# Altium project Dev Board.PrjPcb (part 1 of 2)
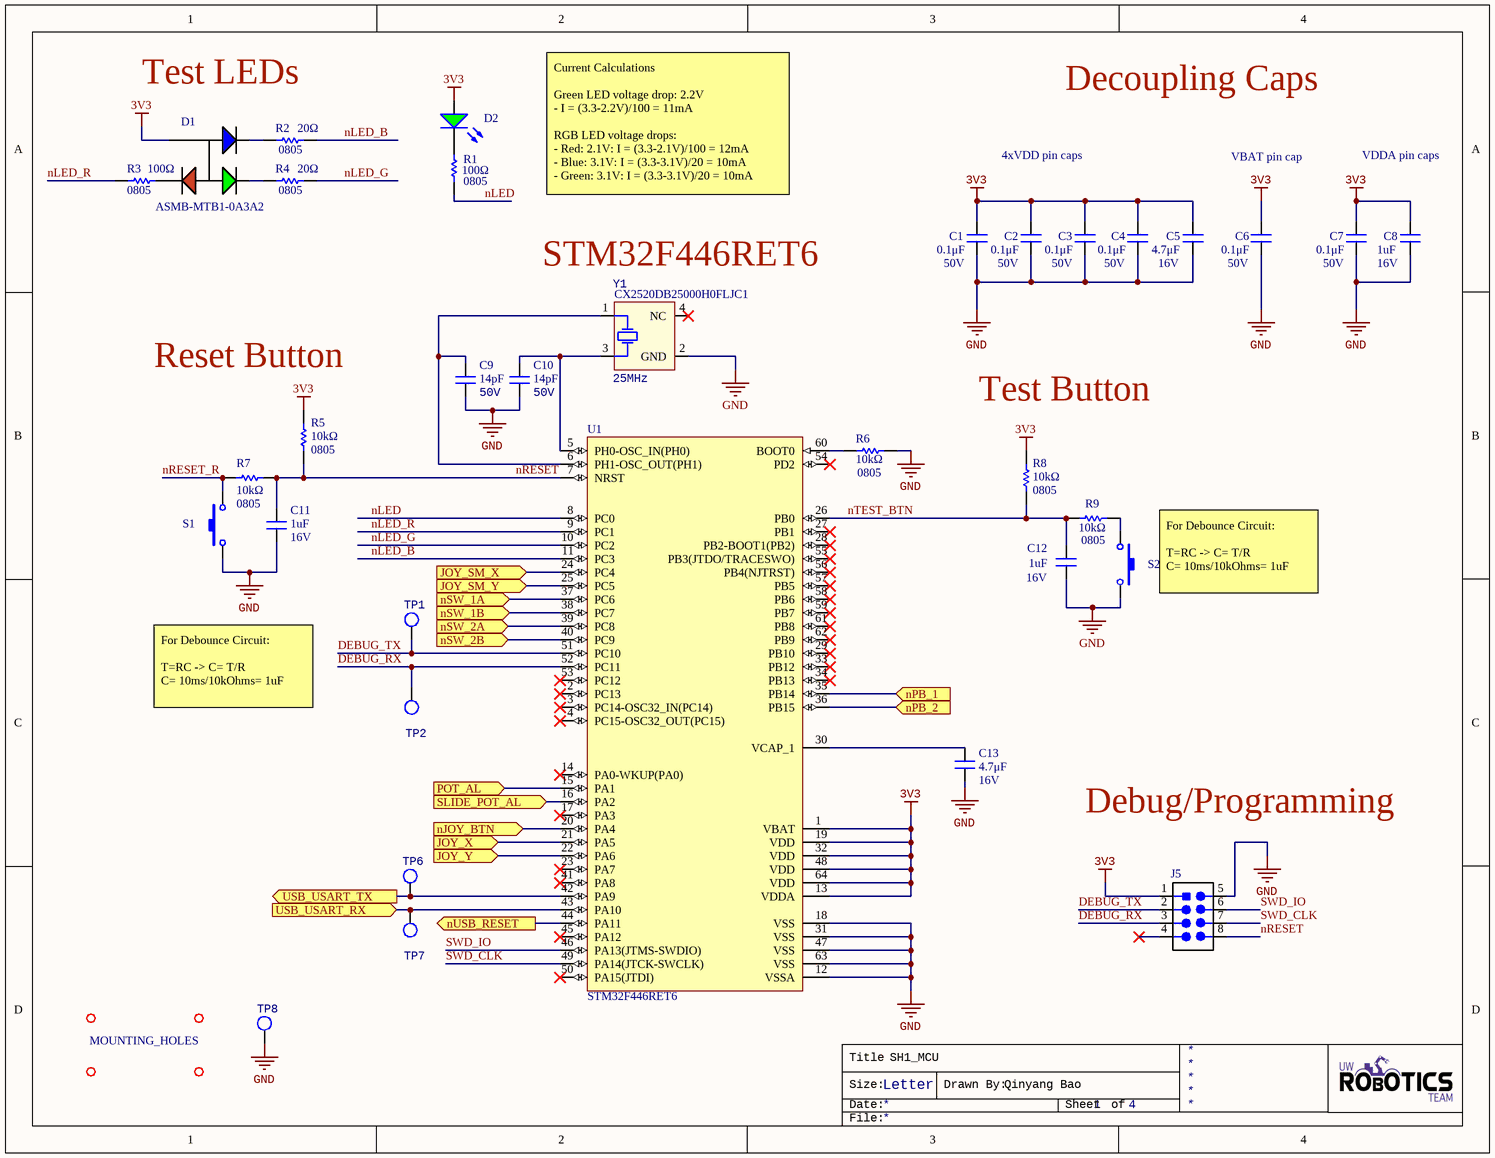
[diagram p0: SH1-MCU.SchDoc]
4 sheets, 108 parts. Net scope: flat (ports and power ports of the same name join across sheets).
Board file: Dev Board.PcbDoc
Sheets:
  SH1-MCU.SchDoc
  SH2-CONTROLS.SchDoc
  SH3-FTDI.SchDoc
  SH4-POWER.SchDoc

## Sheet SH1-MCU.SchDoc: SH1_MCU
size Letter; DrawnBy: Qinyang Bao; SheetNumber: 1; SheetTotal: 4

### Parts
C1  Voltage Rating: 50V  [CAPC2012X140N]  (hidden comment: 0.1μF)
C2  Voltage Rating: 50V  [CAPC2012X140N]  (hidden comment: 0.1μF)
C3  Voltage Rating: 50V  [CAPC2012X140N]  (hidden comment: 0.1μF)
C4  Voltage Rating: 50V  [CAPC2012X140N]  (hidden comment: 0.1μF)
C5  value 4.7μF  Voltage Rating: 16V  [CAPC2012X140N]  (hidden comment: CAP_4.7uF_16V_0805)
C6  Voltage Rating: 50V  [CAPC2012X140N]  (hidden comment: 0.1μF)
C7  Voltage Rating: 50V  [CAPC2012X140N]  (hidden comment: 0.1μF)
C8  value 1uF  Voltage Rating: 16V  [CAPC2012X140N]  (hidden comment: CAP_1uF_16V_0805)
C9  value 14pF  Voltage Rating (DC): 50V  [CAPC0603(1608)55_N]  (hidden comment: CL10C140JB8NNNC)
C10  value 14pF  Voltage Rating (DC): 50V  [CAPC0603(1608)55_N]  (hidden comment: CL10C140JB8NNNC)
C11  value 1uF  Voltage Rating: 16V  [CAPC2012X140N]  (hidden comment: CAP_1uF_16V_0805)
C12  value 1uF  Voltage Rating: 16V  [CAPC2012X140N]  (hidden comment: CAP_1uF_16V_0805)
C13  value 4.7μF  Voltage Rating: 16V  [CAPC2012X140N]  (hidden comment: CAP_4.7uF_16V_0805)
D1  Manufacturer Part Number 1: ASMB-MTB1-0A3A2  [LED_RGB]  (hidden comment: LED_RGB)
D2  LG R971-KN-1  [LED_0805_LINE]  (value not drawn)
J5  HEADER 4X2  [HEADER_2X4]  (value not drawn)
MH1  MOUNTING_HOLES  [MOUNTING_HOLE]  (value not drawn)
MH2  MOUNTING_HOLES  [MOUNTING_HOLE]  (value not drawn)
MH3  MOUNTING_HOLES  [MOUNTING_HOLE]
MH4  MOUNTING_HOLES  [MOUNTING_HOLE]  (value not drawn)
R1  value 100Ω  Case Code (Imperial): 0805  [RESC2012X60N]  (hidden comment: RES_100Ω_0805)
R2  value 20Ω  Case Code (Imperial): 0805  [RESC2012X60N]  (hidden comment: RES_20Ω_0805)
R3  value 100Ω  Case Code (Imperial): 0805  [RESC2012X60N]  (hidden comment: RES_100Ω_0805)
R4  value 20Ω  Case Code (Imperial): 0805  [RESC2012X60N]  (hidden comment: RES_20Ω_0805)
R5  value 10kΩ  Case Code (Imperial): 0805  [RESC2012X60N]  (hidden comment: RES_10kΩ_0805)
R6  value 10kΩ  Case Code (Imperial): 0805  [RESC2012X60N]  (hidden comment: RES_10kΩ_0805)
R7  value 10kΩ  Case Code (Imperial): 0805  [RESC2012X60N]  (hidden comment: RES_10kΩ_0805)
R8  value 10kΩ  Case Code (Imperial): 0805  [RESC2012X60N]  (hidden comment: RES_10kΩ_0805)
R9  value 10kΩ  Case Code (Imperial): 0805  [RESC2012X60N]  (hidden comment: RES_10kΩ_0805)
S1  SW_TACTILE  [B3U-1000P]  (value not drawn)
S2  SW_TACTILE  [B3U-1000P]  (value not drawn)
TP1  TESTPOINT_LOOP  [TESTPOINT_LOOP]  (value not drawn)
TP2  TESTPOINT_LOOP  [TESTPOINT_LOOP]  (value not drawn)
TP6  TESTPOINT_LOOP  [TESTPOINT_LOOP]  (value not drawn)
TP7  TESTPOINT_LOOP  [TESTPOINT_LOOP]  (value not drawn)
TP8  TESTPOINT_LOOP  [TESTPOINT_LOOP]  (value not drawn)
U1  STM32F446RET6  [STM-LQFP64_L]
Y1  Manufacturer Part Number 1: CX2520DB25000H0FLJC1  Frequency: 25MHz  [SOIC254P1016X440-4N]  (hidden comment: CRYSTAL_25MHZ)

### Ports
JOY_SM_X (in), JOY_SM_Y (in), JOY_X (in), JOY_Y (in), nJOY_BTN (in), nPB_1 (in), nPB_2 (in), nSW_1A (in), nSW_1B (in), nSW_2A (in), nSW_2B (in), nUSB_RESET (out), POT_AL (in), SLIDE_POT_AL (in), USB_USART_RX (in), USB_USART_TX (out)

### Nets
3V3: C1.2 C2.2 C3.2 C4.2 C5.2 C6.2 C7.2 C8.2 D1.4 D2.1(A) J5.1(VCC) R5.2 R8.2 U1.1(VBAT) U1.13(VDDA) U1.19(VDD) U1.32(VDD) U1.48(VDD) U1.64(VDD)
GND: C1.1 C2.1 C3.1 C4.1 C5.1 C6.1 C7.1 C8.1 C9.1 C10.1 C11.1 C12.1 C13.1 J5.5(GND) R6.2 S1.2 S2.2 TP8.1 U1.12(VSSA) U1.18(VSS) U1.31(VSS) U1.47(VSS) U1.63(VSS) Y1.2(GND)
DEBUG_RX: J5.3 TP2.1 U1.52(PC11)
DEBUG_TX: J5.2 TP1.1 U1.51(PC10)
nLED: R1.1 U1.8(PC0)
nLED_B: R2.2 U1.11(PC3)
nLED_G: R4.2 U1.10(PC2)
nLED_R: R3.1 U1.9(PC1)
nRESET: C11.2 J5.8 R5.1 R7.2 U1.7(NRST)
nRESET_R: R7.1 S1.1
nTEST_BTN: C12.2 R8.1 R9.1 U1.26(PB0)
SWD_CLK: J5.7 U1.49(PA14(JTCK-SWCLK))
SWD_IO: J5.6 U1.46(PA13(JTMS-SWDIO))
NetC9_2: C9.2 U1.6(PH1-OSC_OUT(PH1)) Y1.1(HOT)
NetC10_2: C10.2 U1.5(PH0-OSC_IN(PH0)) Y1.3(HOT)
NetC13_2: C13.2 U1.30(VCAP_1)
NetC14_2: U1.25(PC5) ; port JOY_SM_Y
NetC15_2: U1.24(PC4) ; port JOY_SM_X
NetC16_2: U1.37(PC6) ; port nSW_1A
NetC17_2: U1.38(PC7) ; port nSW_1B
NetC18_2: U1.39(PC8) ; port nSW_2A
NetC19_2: U1.40(PC9) ; port nSW_2B
NetC20_2: U1.20(PA4) ; port nJOY_BTN
NetC21_2: U1.21(PA5) ; port JOY_X
NetC22_2: U1.22(PA6) ; port JOY_Y
NetC23_2: U1.15(PA1) ; port POT_AL
NetC24_2: U1.35(PB14) ; port nPB_1
NetC25_2: U1.16(PA2) ; port SLIDE_POT_AL
NetC26_2: U1.36(PB15) ; port nPB_2
NetD1_1: D1.1 R3.2
NetD1_2: D1.2 R4.1
NetD1_3: D1.3 R2.1
NetD2_2: D2.2(K) R1.2
NetR6_1: R6.1 U1.60(BOOT0)
NetR9_2: R9.2 S2.1
NetR35_1: U1.44(PA11) ; port nUSB_RESET
NetTP6_1: TP6.1 U1.42(PA9) ; port USB_USART_TX
NetTP7_1: TP7.1 U1.43(PA10) ; port USB_USART_RX

Not connected (* = marked no-connect by the designer): J5 4*; U1 2(PC13)* 3(PC14-OSC32_IN(PC14))* 4(PC15-OSC32_OUT(PC15))* 14(PA0-WKUP(PA0))* 17(PA3)* 23(PA7)* 27(PB1)* 28(PB2-BOOT1(PB2))* 29(PB10)* 33(PB12)* 34(PB13)* 41(PA8)* 45(PA12)* 50(PA15(JTDI))* 53(PC12)* 54(PD2)* 55(PB3(JTDO/TRACESWO))* 56(PB4(NJTRST))* 57(PB5)* 58(PB6)* 59(PB7)* 61(PB8)* 62(PB9)*; Y1 4(NC)*

### Notes on the sheet
- Test LEDs
- Decoupling Caps
- 4xVDD pin caps
- VBAT pin cap
- VDDA pin caps
- Current Calculations
  Green LED voltage drop: 2.2V
  - I = (3.3-2.2V)/100 = 11mA
  RGB LED voltage drops:
  - Red: 2.1V: I = (3.3-2.1V)/100 = 12mA
  - Blue: 3.1V: I = (3.3-3.1V)/20 = 10mA
  - Green: 3.1V: I = (3.3-3.1V)/20 = 10mA
- (near Y1) STM32F446RET6
- (near R5) Reset Button
- Test Button
- For Debounce Circuit:
  T=RC -> C= T/R
  C= 10ms/10kOhms= 1uF
- Debug/Programming
- Title
- Size:
- Date:
- Letter
- Drawn By:
- Sheet
- of
- File:

### Library data of the parts
C1-C4 C6 C7 = CAP_0.1uF_50V_0805: CAP CER 0.1UF 50V X7R 0805; Manufacturer 1: Murata Electronics; Manufacturer Part Number 1: GCD21BR71H104KA01L; Tolerance: 10%; Mount: Surface Mount; Case Code (Metric): 2012; Case Code (Imperial): 0805; Min Operating Temperature: -55°C; Max Operating Temperature: 125°C; Dielectric: X7R; Termination: SMD/SMT; Length: 2mm; Height: 1.25mm; Width: 0.049inch; Thickness: 0.049inch; Depth: 1.25mm; Ratings: AEC-Q200; ComponentLink1URL: https://datasheet.ciiva.com/29537/c03e-29537701.pdf?src-supplier=Digi-Key; ComponentLink1Description: https://datasheet.ciiva.com/29537/c03e-29537701.pdf?src-supplier=Digi-Key; Supplier 1: Digi-Key; Supplier Part Number 1: 490-11955-1-ND; Value: 0.1μF; Package: 0805 (2012 Metric)
C5 C13 = CAP_4.7uF_16V_0805: CAP CER 4.7UF 16V X5R 0805; Manufacturer 1: Samsung Electro-Mechanics; Manufacturer Part Number 1: CL21A475KOFNNNE; Tolerance: 10%; Mount: Surface Mount; Case Code (Metric): 2012; Case Code (Imperial): 0805; Min Operating Temperature: -55°C; Max Operating Temperature: 85°C; Dielectric: X5R; Termination: SMD/SMT; Supplier 1: Digi-Key; Supplier Part Number 1: 1276-1065-1-ND; Package: 0805 (2012 Metric)
C8 C11 C12 = CAP_1uF_16V_0805: CAP CER 1UF 16V X7R 0805; Manufacturer 1: Yageo; Manufacturer Part Number 1: CC0805KKX7R7BB105; Tolerance: 10%; Mount: Surface Mount; Case Code (Metric): 2012; Case Code (Imperial): 0805; Min Operating Temperature: -55°C; Max Operating Temperature: 125°C; Dielectric: X7R; Termination: SMD/SMT; Supplier 1: Digi-Key; Supplier Part Number 1: 311-1365-1-ND; Package: 0805 (2012 Metric)
C9 C10 = CL10C140JB8NNNC: Cap Ceramic 14pF 50V C0G 5% SMD 0603 125C Cardboard T/R; Manufacturer 1: Samsung; Voltage Rating: 50V; Supplier Part Number 1: 1276-2187-1-ND; Supplier 1: Digi-Key; Manufacturer Part Number 1: CL10C140JB8NNNC; Stock 1: 187088; Pricing 1: 1=0.10000, 10=0.06700, 100=0.02980, 500=0.02130, 1000=0.01673 (USD); RoHS: Yes; Mount: Surface Mount; Case/Package: 0603; Case Code (Metric): 1608; Case Code (Imperial): 0603; Min Operating Temperature: -55°C; Max Operating Temperature: 125°C; Tolerance: 5%; Package Quantity: 1; Packaging: Tape and Reel; Dielectric: C0G; Length: 1.6mm; Height: 0.8mm; Width: 0.031inch; Depth: 0.8mm; Thickness: 0.035inch; Radiation Hardening: No; ComponentLink1URL: https://datasheet.ciiva.com/25782/cl10c140jb8nnnc-25782947.pdf?src-supplier=Digi-Key; ComponentLink1Description: https://datasheet.ciiva.com/25782/cl10c140jb8nnnc-25782947.pdf?src-supplier=Digi-Key; Capacitance: 14pF
D1 = LED_RGB: LED RGB DIFFUSED 4PLCC SMD; Manufacturer 1: Broadcom; Color: Blue,Green,Red; Lens Color: White; Viewing Angle: 115°; Lens Style: Round; Luminous Intensity: 350mcd; Dominant Wavelength: 470nm; Forward Voltage: 3.1V; Test Current: 20mA; Supplier 1: Digi-Key; Stock 1: 142531; Pricing 1: 1=0.60000, 10=0.47100, 100=0.30210, 500=0.25980, 1000=0.20059 (USD); RoHS: Yes; Mount: Surface Mount; Case/Package: PLCC; Number of Pins: 4; Packaging: Cut Tape; Lens Transparency: Diffused; Length: 3.2mm; Height: 1.9mm; Width: 2.8mm; REACH SVHC: No SVHC; ComponentLink1URL: http://www.farnell.com/datasheets/2111106.pdf?src-supplier=Farnell; ComponentLink1Description: http://www.farnell.com/datasheets/2111106.pdf?src-supplier=Farnell; ComponentLink2URL: https://docs.broadcom.com/docs/AV02-4194EN?src-supplier=Digi-Key; ComponentLink2Description: https://docs.broadcom.com/docs/AV02-4194EN?src-supplier=Digi-Key; ComponentLink3URL: http://www.farnell.com/datasheets/1801564.pdf?src-supplier=Element14; ComponentLink3Description: http://www.farnell.com/datasheets/1801564.pdf?src-supplier=Element14; ComponentLink4URL: http://www.farnell.com/datasheets/2111106.pdf?src-supplier=Newark; ComponentLink4Description: http://www.farnell.com/datasheets/2111106.pdf?src-supplier=Newark; Supplier Part Number 1: 516-3280-1-ND
D2 = DIO_LED_G: LED GREEN DIFFUSED 0805 SMD; Manufacturer 1: OSRAM; Forward Voltage Drop: 2.2V; Package: 0805 (2012 Metric); Supplier Part Number 1: 475-1410-1-ND; Supplier 1: Digi-Key; Manufacturer Part Number 1: LG R971-KN-1; Mount: Surface Mount
J5 = HEADER 4X2: CONN HEADER VERT 8POS 2.54MM; Manufacturer Part Number 1: M20-9980445; Manufacturer 1: Harwin Inc.; Supplier Part Number 1: 952-2122-ND; Supplier 1: Digi-Key; Mount: Through Hole
MH1-MH4 = MOUNTING_HOLES: 6cm x 6cm
R1 R3 = RES_100Ω_0805: RES SMD 100 OHM 1% 1/8W 0805; Manufacturer 1: Yageo; Manufacturer Part Number 1: RC0805FR-07100RL; Power Rating: 125mW; Supplier 1: Digi-Key; Mount: Surface Mount; Case Code (Metric): 2012; Supplier Part Number 1: 311-100CRCT-ND; Package: 0805 (2012 Metric)
R2 R4 = RES_20Ω_0805: RES SMD 20 OHM 1% 1/8W 0805; Manufacturer 1: Yageo; Manufacturer Part Number 1: RC0805FR-0720RL; Resistance: 20; Power Rating: 125mW; Supplier 1: Digi-Key; Case Code (Metric): 2012; Min Operating Temperature: -55°C; Max Operating Temperature: 155°C; Tolerance: 1%; Termination: SMD/SMT; Supplier Part Number 1: 311-20.0CRCT-ND; Package: 0805 (2012 Metric)
R5-R9 = RES_10kΩ_0805: RES SMD 10K OHM 1% 1/8W 0805; Manufacturer 1: Yageo; Manufacturer Part Number 1: RC0805FR-0710KL; Power Rating: 125mW; Supplier 1: Digi-Key; Case Code (Metric): 2012; Min Operating Temperature: -55°C; Max Operating Temperature: 155°C; Resistance: 10K; Tolerance: 1%; Termination: SMD/SMT; Supplier Part Number 1: 311-10.0KCRCT-ND; Package: 0805 (2012 Metric)
S1 S2 = SW_TACTILE: Tactile Switch (Grey); Manufacturer 1: Omron Electronics Inc-EMC Div; Manufacturer Part Number 1: B3U-1000P; Supplier 1: Digi-Key; Supplier Part Number 1: SW1020CT-ND; Mount: Surface Mount
TP1 TP2 TP6-TP8 = TESTPOINT_LOOP: Loop testpoint through-hole pad; Manufacturer Part Number 1: 5002; Manufacturer 1: Keystone Electronics; Supplier Part Number 1: 36-5002-ND; Supplier 1: Digi-Key; Mount: Through Hole
U1 = MCU_STM32F446RET6: ARM Cortex-M4 32-bit MCU+FPU, 512 KB Flash, 128 KB Internal RAM, 50 I/Os, 64-Pin LQFP, -40 to 85 degC, Tray; I/Os (High Current): 50; Supply Voltage(Vcc) min (V): 1.7; Operating Frequency(F) (Processor speed) (MHz): 180; D/A Converter: 2; Internal RAM Size (kB): 128; FLASH Size (Prog) (kB): 512; Core: ARM Cortex-M4; ComponentLink1Description: Manufacturer URL; Package Reference: 64-Pin Low-profile Quad Flat Package, Body 10 x 10 mm, Pitch 0.5 mm; ComponentLink2URL: http://www.st.com/st-web-ui/static/active/en/resource/technical/document/datasheet/DM00141306.pdf; Packing: Tray; DatasheetVersion: Rev. 6; ComponentLink1URL: http://www.st.com/; ComponentLink2Description: Datasheet; Package Description: LQFP64; Mounting Technology: Surface Mount; Supplier Part Number 1: 497-15376-ND; Supplier 1: Digi-Key
Y1 = CRYSTAL_25MHZ: CRYSTAL 25.0000MHZ 12PF SMD; Manufacturer 1: Kyocera AVX; ESR (Equivalent Series Resistance): 80R; Frequency Stability: 15ppm; Frequency Tolerance: 10ppm; ComponentLink1Description: https://media.digikey.com/pdf/Data%20Sheets/AVX%20PDFs/CX2520DB_USY1M-H1-16429-00_Spec.pdf?src-supplier=Digi-Key; ComponentLink1URL: https://media.digikey.com/pdf/Data%20Sheets/AVX%20PDFs/CX2520DB_USY1M-H1-16429-00_Spec.pdf?src-supplier=Digi-Key; Supplier 1: Digi-Key; Supplier Part Number 1: 1253-1724-1-ND; Stock 1: 11741; Pricing 1: 1=0.72000, 10=0.63300, 50=0.59120, 100=0.52250, 500=0.49500, 1000=0.41250 (USD); RoHS: Yes; Mount: Surface Mount; Case/Package: SMD/SMT; Min Operating Temperature: -30°C; Max Operating Temperature: 85°C; Packaging: Tape and Reel; Load Capacitance: 12pF; Length: 0.098inch; Height: 0.022inch; Width: 0.079inch; Ratings: AEC-Q200

## Sheet SH2-CONTROLS.SchDoc: SH2-CONTROLS
size Letter; DrawnBy: Qinyang Bao; SheetNumber: 2; SheetTotal: 4
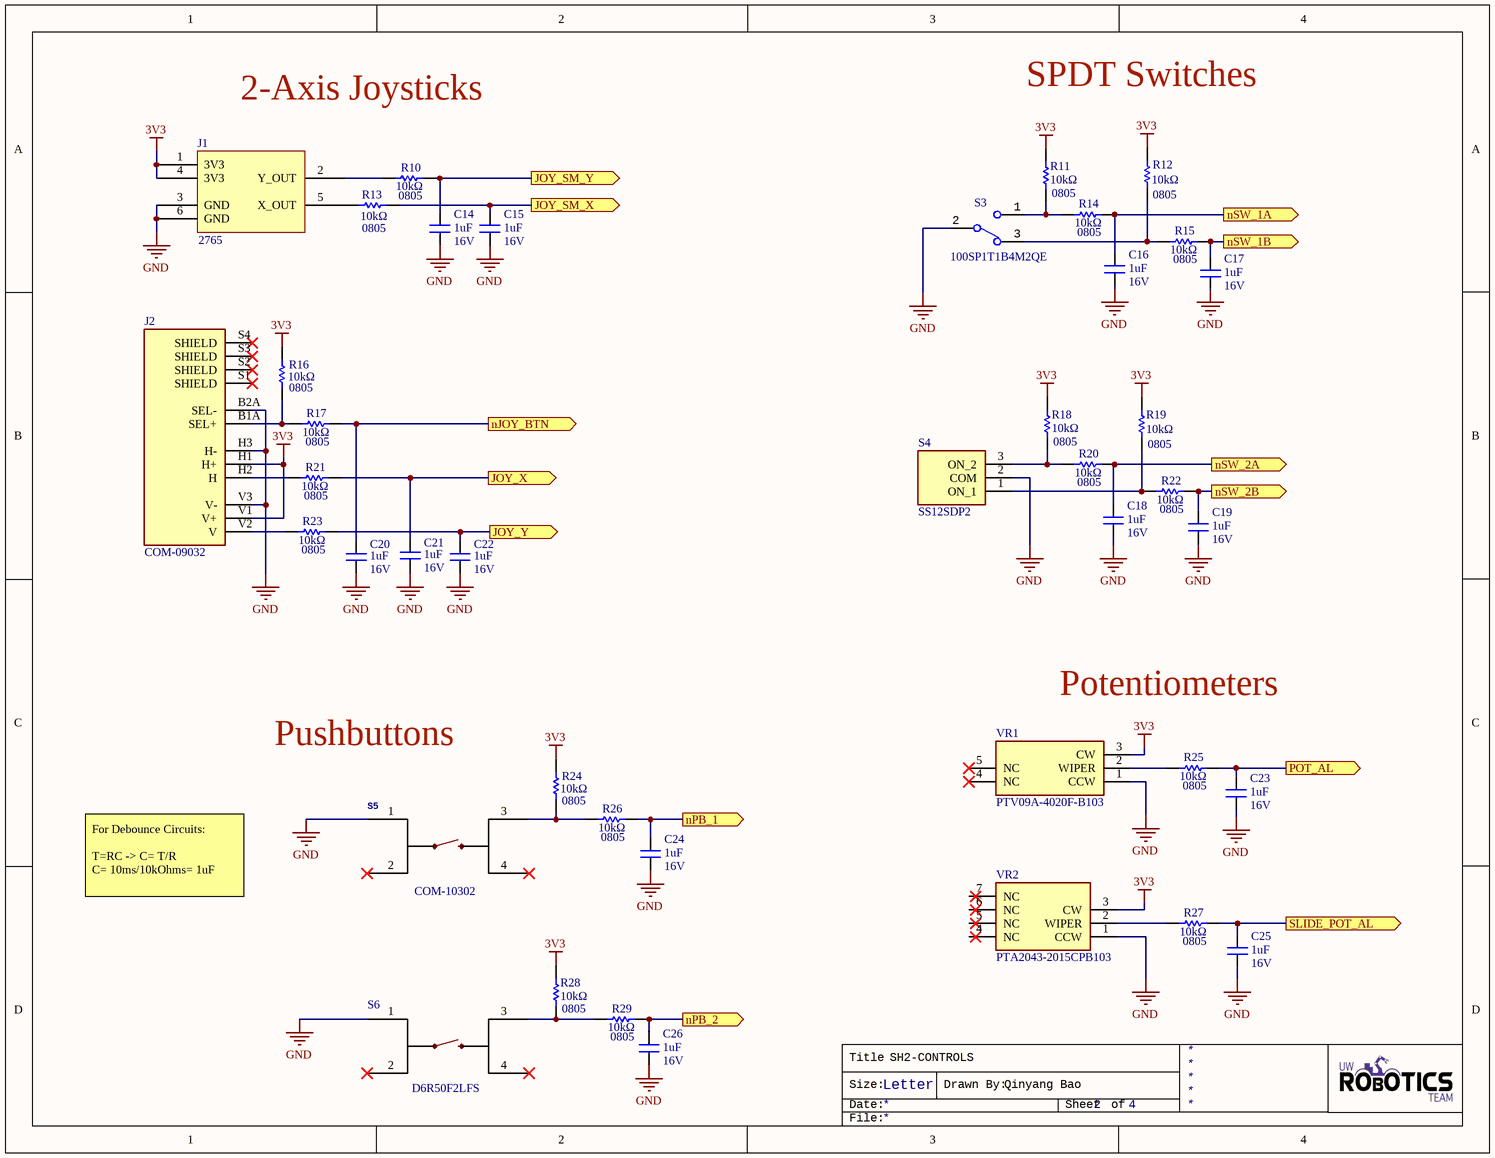
[diagram p1: SH2-CONTROLS.SchDoc]

### Parts
C14  value 1uF  Voltage Rating: 16V  [CAPC2012X140N]  (hidden comment: CAP_1uF_16V_0805)
C15  value 1uF  Voltage Rating: 16V  [CAPC2012X140N]  (hidden comment: CAP_1uF_16V_0805)
C16  value 1uF  Voltage Rating: 16V  [CAPC2012X140N]  (hidden comment: CAP_1uF_16V_0805)
C17  value 1uF  Voltage Rating: 16V  [CAPC2012X140N]  (hidden comment: CAP_1uF_16V_0805)
C18  value 1uF  Voltage Rating: 16V  [CAPC2012X140N]  (hidden comment: CAP_1uF_16V_0805)
C19  value 1uF  Voltage Rating: 16V  [CAPC2012X140N]  (hidden comment: CAP_1uF_16V_0805)
C20  value 1uF  Voltage Rating: 16V  [CAPC2012X140N]  (hidden comment: CAP_1uF_16V_0805)
C21  value 1uF  Voltage Rating: 16V  [CAPC2012X140N]  (hidden comment: CAP_1uF_16V_0805)
C22  value 1uF  Voltage Rating: 16V  [CAPC2012X140N]  (hidden comment: CAP_1uF_16V_0805)
C23  value 1uF  Voltage Rating: 16V  [CAPC2012X140N]  (hidden comment: CAP_1uF_16V_0805)
C24  value 1uF  Voltage Rating: 16V  [CAPC2012X140N]  (hidden comment: CAP_1uF_16V_0805)
C25  value 1uF  Voltage Rating: 16V  [CAPC2012X140N]  (hidden comment: CAP_1uF_16V_0805)
C26  value 1uF  Voltage Rating: 16V  [CAPC2012X140N]  (hidden comment: CAP_1uF_16V_0805)
J1  Manufacturer Part Number 1: 2765  [2_AXIS_JOY_SMALL]  (hidden comment: 2_AXIS_JOYSTICK_SMALL)
J2  Manufacturer Part Number 1: COM-09032  [2_AXIS_JOY]  (hidden comment: 2_AXIS_JOYSTICK)
R10  value 10kΩ  Case Code (Imperial): 0805  [RESC2012X60N]  (hidden comment: RES_10kΩ_0805)
R11  value 10kΩ  Case Code (Imperial): 0805  [RESC2012X60N]  (hidden comment: RES_10kΩ_0805)
R12  value 10kΩ  Case Code (Imperial): 0805  [RESC2012X60N]  (hidden comment: RES_10kΩ_0805)
R13  value 10kΩ  Case Code (Imperial): 0805  [RESC2012X60N]  (hidden comment: RES_10kΩ_0805)
R14  value 10kΩ  Case Code (Imperial): 0805  [RESC2012X60N]  (hidden comment: RES_10kΩ_0805)
R15  value 10kΩ  Case Code (Imperial): 0805  [RESC2012X60N]  (hidden comment: RES_10kΩ_0805)
R16  value 10kΩ  Case Code (Imperial): 0805  [RESC2012X60N]  (hidden comment: RES_10kΩ_0805)
R17  value 10kΩ  Case Code (Imperial): 0805  [RESC2012X60N]  (hidden comment: RES_10kΩ_0805)
R18  value 10kΩ  Case Code (Imperial): 0805  [RESC2012X60N]  (hidden comment: RES_10kΩ_0805)
R19  value 10kΩ  Case Code (Imperial): 0805  [RESC2012X60N]  (hidden comment: RES_10kΩ_0805)
R20  value 10kΩ  Case Code (Imperial): 0805  [RESC2012X60N]  (hidden comment: RES_10kΩ_0805)
R21  value 10kΩ  Case Code (Imperial): 0805  [RESC2012X60N]  (hidden comment: RES_10kΩ_0805)
R22  value 10kΩ  Case Code (Imperial): 0805  [RESC2012X60N]  (hidden comment: RES_10kΩ_0805)
R23  value 10kΩ  Case Code (Imperial): 0805  [RESC2012X60N]  (hidden comment: RES_10kΩ_0805)
R24  value 10kΩ  Case Code (Imperial): 0805  [RESC2012X60N]  (hidden comment: RES_10kΩ_0805)
R25  value 10kΩ  Case Code (Imperial): 0805  [RESC2012X60N]  (hidden comment: RES_10kΩ_0805)
R26  value 10kΩ  Case Code (Imperial): 0805  [RESC2012X60N]  (hidden comment: RES_10kΩ_0805)
R27  value 10kΩ  Case Code (Imperial): 0805  [RESC2012X60N]  (hidden comment: RES_10kΩ_0805)
R28  value 10kΩ  Case Code (Imperial): 0805  [RESC2012X60N]  (hidden comment: RES_10kΩ_0805)
R29  value 10kΩ  Case Code (Imperial): 0805  [RESC2012X60N]  (hidden comment: RES_10kΩ_0805)
S3  SW_SPDT  [100SP1T1B4M2QE]  (value not drawn)
S4  SW_SPDT_SMALL  [SS12SDP2]  (value not drawn)
S5  Manufacturer Part Number 1: COM-10302  [TACTILE_SWITCH_PTH_12MM]  (hidden comment: Pushbutton)
S6  Manufacturer Part Number 1: D6R50F2LFS  [D6R]  (hidden comment: MOMENTARY_SWITCH_D6R)
VR1  Manufacturer Part Number 1: PTV09A-4020F-B103  [PTV09A4020FB103]  (hidden comment: POT_10K)
VR2  Manufacturer Part Number 1: PTA2043-2015CPB103  [PTA20432015CPB103]  (hidden comment: POT_10K_SLIDE)

### Ports
JOY_SM_X (out), JOY_SM_Y (out), JOY_X (out), JOY_Y (out), nJOY_BTN (out), nPB_1 (out), nPB_2 (out), nSW_1A (out), nSW_1B (out), nSW_2A (out), nSW_2B (out), POT_AL (out), SLIDE_POT_AL (out)

### Nets
3V3: J1.1(3V3) J1.4(3V3) J2.H1(H+) J2.V1(V+) R11.1 R12.1 R16.1 R18.1 R19.1 R24.1 R28.1 VR1.3(CW) VR2.3(CW)
GND: C14.1 C15.1 C16.1 C17.1 C18.1 C19.1 C20.1 C21.1 C22.1 C23.1 C24.1 C25.1 C26.1 J1.3(GND) J1.6(GND) J2.B2A(SEL-) J2.H3(H-) J2.V3(V-) S3.2 S4.2(COM) S5.1 S6.1 VR1.1(CCW) VR2.1(CCW)
NetC14_2: C14.2 R10.2 ; port JOY_SM_Y
NetC15_2: C15.2 R13.2 ; port JOY_SM_X
NetC16_2: C16.2 R14.2 ; port nSW_1A
NetC17_2: C17.2 R15.2 ; port nSW_1B
NetC18_2: C18.2 R20.2 ; port nSW_2A
NetC19_2: C19.2 R22.2 ; port nSW_2B
NetC20_2: C20.2 R17.2 ; port nJOY_BTN
NetC21_2: C21.2 R21.2 ; port JOY_X
NetC22_2: C22.2 R23.2 ; port JOY_Y
NetC23_2: C23.2 R25.2 ; port POT_AL
NetC24_2: C24.2 R26.2 ; port nPB_1
NetC25_2: C25.2 R27.2 ; port SLIDE_POT_AL
NetC26_2: C26.2 R29.2 ; port nPB_2
NetJ1_2: J1.2(Y_OUT) R10.1
NetJ1_5: J1.5(X_OUT) R13.1
NetJ2_B1A: J2.B1A(SEL+) R16.2 R17.1
NetJ2_H2: J2.H2(H) R21.1
NetJ2_V2: J2.V2(V) R23.1
NetR11_2: R11.2 R14.1 S3.1
NetR12_2: R12.2 R15.1 S3.3
NetR18_2: R18.2 R20.1 S4.3(ON_2)
NetR19_2: R19.2 R22.1 S4.1(ON_1)
NetR24_2: R24.2 R26.1 S5.3
NetR25_1: R25.1 VR1.2(WIPER)
NetR27_1: R27.1 VR2.2(WIPER)
NetR28_2: R28.2 R29.1 S6.3

Not connected (* = marked no-connect by the designer): J2 S1(SHIELD)* S2(SHIELD)* S3(SHIELD)* S4(SHIELD)*; S5 2* 4*; S6 2* 4*; VR1 4(NC)* 5(NC)*; VR2 4(NC) 5(NC) 6(NC) 7(NC)

### Notes on the sheet
- SPDT Switches
- 2-Axis Joysticks
- Potentiometers
- Pushbuttons
- For Debounce Circuits:
  T=RC -> C= T/R
  C= 10ms/10kOhms= 1uF
- Title
- Size:
- Date:
- Letter
- Drawn By:
- Sheet
- of
- File:

### Library data of the parts
C14-C26 = CAP_1uF_16V_0805: as C8 on sheet SH1-MCU; Mount: Surface Mount; Case Code (Metric): 2012; Case Code (Imperial): 0805; Min Operating Temperature: -55°C; Max Operating Temperature: 125°C; Dielectric: X7R; Termination: SMD/SMT; Supplier 1: Digi-Key; Supplier Part Number 1: 311-1365-1-ND; Package: 0805 (2012 Metric)
J1 = 2_AXIS_JOYSTICK_SMALL: JOYSTICK 10K OHM 2 AXIS TH; Manufacturer 1: Adafruit Industries; Resistance: 10kR; Supplier 1: Digi-Key; Stock 1: 351; Pricing 1: 1=2.50000 (USD); RoHS: Yes; Mount: Through Hole; Packaging: Bulk; Length: 0.707inch; Height: 0.472inch; Width: 0.697inch; ComponentLink1URL: https://media.digikey.com/pdf/Data%20Sheets/Adafruit%20PDFs/2765_Web.pdf?src-supplier=Digi-Key; ComponentLink1Description: https://media.digikey.com/pdf/Data%20Sheets/Adafruit%20PDFs/2765_Web.pdf?src-supplier=Digi-Key; Supplier Part Number 1: 1528-1730-ND
J2 = 2_AXIS_JOYSTICK: JOYSTICK 10K OHM 2 AXIS TH; Manufacturer 1: SparkFun; Supplier 1: Digi-Key; Stock 1: 1039; Pricing 1: 1=3.95000 (USD); RoHS: No; ComponentLink1URL: https://media.digikey.com/pdf/Data%20Sheets/Sparkfun%20PDFs/COM-09032_Web.pdf?src-supplier=Digi-Key; ComponentLink1Description: https://media.digikey.com/pdf/Data%20Sheets/Sparkfun%20PDFs/COM-09032_Web.pdf?src-supplier=Digi-Key; Supplier Part Number 1: 1568-1526-ND
R10-R29 = RES_10kΩ_0805: as R5 on sheet SH1-MCU; Supplier 1: Digi-Key; Case Code (Metric): 2012; Min Operating Temperature: -55°C; Max Operating Temperature: 155°C; Resistance: 10K; Tolerance: 1%; Termination: SMD/SMT; Supplier Part Number 1: 311-10.0KCRCT-ND; Package: 0805 (2012 Metric)
S3 = SW_SPDT: SWITCH TOGGLE SPDT 5A 120V; Manufacturer 1: E-Switch; Actuator Material: Brass,Chrome; Switch Function: On-On; Voltage Rating (DC): 28V; Illumination Type: Non-Illuminated,Illuminated; Actuator Type: Standard Round; Electrical Life: 40000Cycles; Actuator Length: 12.19mm; ComponentLink1URL: https://datasheet.ciiva.com/24455/t111597-24455739.pdf?src-supplier=Onlinecomponents.com; ComponentLink1Description: https://datasheet.ciiva.com/24455/t111597-24455739.pdf?src-supplier=Onlinecomponents.com; ComponentLink2URL: https://datasheet.ciiva.com/2905/t111597-2905494.pdf?src-supplier=Digi-Key; ComponentLink2Description: https://datasheet.ciiva.com/2905/t111597-2905494.pdf?src-supplier=Digi-Key; Supplier 1: Digi-Key; Manufacturer Part Number 1: 100SP1T1B4M2QE; Stock 1: 4845; Pricing 1: 1=1.99000, 10=1.77900, 25=1.68240, 50=1.60200, 100=1.52950, 250=1.46512, 500=1.36850, 1000=1.30410 (USD); RoHS: Yes; Mount: Through Hole; Contact Material: Silver; Contact Plating: Silver; Min Operating Temperature: -30°C; Max Operating Temperature: 85°C; Package Quantity: 1; Current Rating: 5A; Voltage Rating (AC): 120V; Packaging: Bulk; Orientation: Vertical; Termination: PC Pin; Throw Configuration: SPDT; Lead Free: Lead Free; Supplier Part Number 1: EG2355-ND
S4 = SW_SPDT_SMALL: SWITCH SLIDE SPDT 100MA 30V; Manufacturer 1: NKK Switches; Actuator Material: Polyamide,Polyacetal; Mechanical Life: 10000Cycles; Switch Travel: 2mm; Illumination Type: Non-Illuminated; Switch Function: On-On; Voltage Rating (AC): 28V; Insulation Resistance: 100MR; Contact Resistance: 20mR; Number of Positions: 2; Actuator Type: Standard; Number of Poles: 1; Supplier 1: Digi-Key; Manufacturer Part Number 1: SS12SDP2; Stock 1: 4905; Pricing 1: 1=1.56000, 10=1.50000, 25=1.41000, 100=1.21800, 250=1.11000, 500=1.03200, 1000=0.96000, 2500=0.87000, 5000=0.81000 (USD); RoHS: Yes; Mount: PCB,Through Hole; Contact Material: Brass,Silver,Bronze; Contact Plating: Silver; Housing Material: Thermoplastic; Body Material: Polyamide,Polyacetal; Min Operating Temperature: -15°C; Max Operating Temperature: 60°C; Throw Configuration: SPDT; Packaging: Tray; Orientation: Straight; Termination: PC Pins; Voltage Rating (DC): 30V; Electrical Life: 10000Cycles; Current Rating: 100mA; Contact Current Rating: 100mA; Package Quantity: 1; Max Current Rating: 100mA; Max Voltage Rating (DC): 30V; Length: 10.2mm; Height: 6.5mm; Actuator Length: 2mm; Depth: 4mm; Lead Free: Lead Free; REACH SVHC: No SVHC; Flammability Rating: UL94 V-0; ComponentLink1URL: https://datasheet.ciiva.com/19453/1915771-19453348.pdf?src-supplier=Jameco; ComponentLink1Description: https://datasheet.ciiva.com/19453/1915771-19453348.pdf?src-supplier=Jameco; ComponentLink2URL: https://datasheet.ciiva.com/29119/704240-da-01-en-schiebes-spdt-on-on-2x2-oben-bet-silb-29119647.pdf?src-supplier=Conrad; ComponentLink2Description: https://datasheet.ciiva.com/29119/704240-da-01-en-schiebes-spdt-on-on-2x2-oben-bet-silb-29119647.pdf?src-supplier=Conrad; ComponentLink3URL: https://datasheet.ciiva.com/1532/10312-1532339.pdf?src-supplier=Element14; ComponentLink3Description: https://datasheet.ciiva.com/1532/10312-1532339.pdf?src-supplier=Element14; ComponentLink4URL: https://datasheet.ciiva.com/16394/ssnonilluminated-16394655.pdf?src-supplier=Future+Electronics; ComponentLink4Description: https://datasheet.ciiva.com/16394/ssnonilluminated-16394655.pdf?src-supplier=Future+Electronics; Supplier Part Number 1: 360-2133-ND
S5 = MOMENTARY_SWITCH_TH: Momentary Switch (Pushbutton) - SPST; Manufacturer 1: SparkFun; SymbolName_1: SWITCH-MOMENTARY-2; PROD_ID: SWCH-09185; SF_SKU: COM-09190; Package: TACTILE_SWITCH_PTH_12MM; Supplier 1: Digi-Key; Stock 1: 32; Pricing 1: 1=5.85000 (USD); RoHS: No; Mount: Through Hole; Throw Configuration: SPST; Termination: PC Pin; ComponentLink1URL: https://www.sparkfun.com/datasheets/Components/Buttons/TSA12110%20TACT%20SWITCH.jpg?src-supplier=Digi-Key; ComponentLink1Description: https://www.sparkfun.com/datasheets/Components/Buttons/TSA12110%20TACT%20SWITCH.jpg?src-supplier=Digi-Key; Supplier Part Number 1: 1568-1332-ND
S6 = MOMENTARY_SWITCH_D6R: SWITCH PUSH SPST-NO 0.1A 32V; Manufacturer 1: ITT C&K; Current Rating: 100mA; Throw Configuration: SPST; Operating Force: 2.5N; Actuator Type: Round, Button; Switch Function: Off-Mom; Electrical Life: 250000Cycles; Actuator Length: 7mm; Row Spacing: 5mm; Supplier 1: Digi-Key; Stock 1: 4683; Pricing 1: 1=1.10000, 10=0.98000, 25=0.93080, 50=0.88520, 100=0.84370, 250=0.80652, 500=0.72380, 1000=0.68244 (USD); RoHS: Yes; Mount: Through Hole; Contact Plating: Silver; Number of Terminals: 4; Min Operating Temperature: -20°C; Max Operating Temperature: 85°C; Max Voltage Rating (DC): 32V; Packaging: Bulk; Package Quantity: 2500; Voltage Rating (DC): 32V; Max Current Rating: 100mA; Orientation: Straight; Termination: PC Pin; Diameter: 12mm; Terminal Pitch: 5mm; Lead Free: Lead Free; ComponentLink1URL: https://datasheet.ciiva.com/2869/d6-31aug10-2869553.pdf?src-supplier=Digi-Key; ComponentLink1Description: https://datasheet.ciiva.com/2869/d6-31aug10-2869553.pdf?src-supplier=Digi-Key; ComponentLink2URL: https://datasheet.ciiva.com/12449/d6-31aug10-19155-12449292.pdf?src-supplier=Mouser; ComponentLink2Description: https://datasheet.ciiva.com/12449/d6-31aug10-19155-12449292.pdf?src-supplier=Mouser; ComponentLink3URL: https://datasheet.ciiva.com/16156/d6-4feb-16156540.pdf?src-supplier=Onlinecomponents.com; ComponentLink3Description: https://datasheet.ciiva.com/16156/d6-4feb-16156540.pdf?src-supplier=Onlinecomponents.com; Supplier Part Number 1: 401-1993-ND
VR1 = POT_10K: POT 10K OHM 1/20W CARBON LINEAR; Manufacturer 1: Bourns; Number of Turns: 1; Max Power Dissipation: 50mW; Resistance: 10kR; Tolerance: 20%; Voltage Rating (DC): 20V; Actuator Length: 0.787inch; Actuator Diameter: 0.236inch; ComponentLink1URL: https://datasheet.ciiva.com/6249/ptv09-6249579.pdf?src-supplier=Digi-Key; ComponentLink1Description: https://datasheet.ciiva.com/6249/ptv09-6249579.pdf?src-supplier=Digi-Key; Supplier 1: Digi-Key; Stock 1: 629; Pricing 1: 1=0.83000, 10=0.74400, 25=0.67200, 50=0.64800, 100=0.61200, 250=0.58800, 500=0.55200, 1000=0.45600, 5000=0.37200 (USD); RoHS: Yes; Mount: Through Hole,Snap in,Brackets; Min Operating Temperature: -10°C; Max Operating Temperature: 50°C; Taper: Linear; Termination: Pin; Number of Gangs: 1; Military Standard: Not; Composition: Carbon; Type: Potentiometer; Packaging: Bulk; Power Rating: 50mW; Package Quantity: 100; Voltage Rating: 20V; Length: 11.4mm; Depth: 12.5mm; Radiation Hardening: No; REACH SVHC: No SVHC; ComponentLink2URL: https://datasheet.ciiva.com/11831/0900766b80fa58ec-11831036.pdf?src-supplier=RSComponents; ComponentLink2Description: https://datasheet.ciiva.com/11831/0900766b80fa58ec-11831036.pdf?src-supplier=RSComponents; ComponentLink3URL: https://datasheet.ciiva.com/6249/ptv09-6249723.pdf?src-supplier=Digi-Key; ComponentLink3Description: https://datasheet.ciiva.com/6249/ptv09-6249723.pdf?src-supplier=Digi-Key; ComponentLink4URL: https://datasheet.ciiva.com/30228/24ptv09-30228045.pdf?src-supplier=Onlinecomponents.com; ComponentLink4Description: https://datasheet.ciiva.com/30228/24ptv09-30228045.pdf?src-supplier=Onlinecomponents.com; Supplier Part Number 1: PTV09A-4020F-B103-ND
VR2 = POT_10K_SLIDE: SLIDE POT 10K OHM 0.1W TOP 20MM; Manufacturer 1: Bourns; Max Power Dissipation: 100mW; Tolerance: 20%; Resistance: 10kR; Supplier 1: Digi-Key; Stock 1: 2296; Pricing 1: 1=1.29000, 10=1.14000, 25=1.02600, 50=0.98800, 100=0.95000, 250=0.89300, 500=0.76000, 1000=0.70300, 5000=0.57760 (USD); RoHS: Yes; Mount: Through Hole; Min Operating Temperature: -10°C; Max Operating Temperature: 50°C; Packaging: Tray; Composition: Potentiometer; Type: Potentiometer; Termination: Pin; Taper: Linear; Military Standard: Not; Package Quantity: 100; Power Rating: 100mW; Length: 1.378inch; Height: 0.256inch; Width: 0.354inch; Depth: 9mm; REACH SVHC: No SVHC; ComponentLink1URL: https://datasheet.ciiva.com/6248/pta-6248474.pdf?src-supplier=Digi-Key; ComponentLink1Description: https://datasheet.ciiva.com/6248/pta-6248474.pdf?src-supplier=Digi-Key; Supplier Part Number 1: PTA2043-2015CPB103-ND

## Sheet SH3-FTDI.SchDoc: SH3_FTDI
size Letter; DrawnBy: Christopher Arjune; SheetNumber: 3; SheetTotal: 4
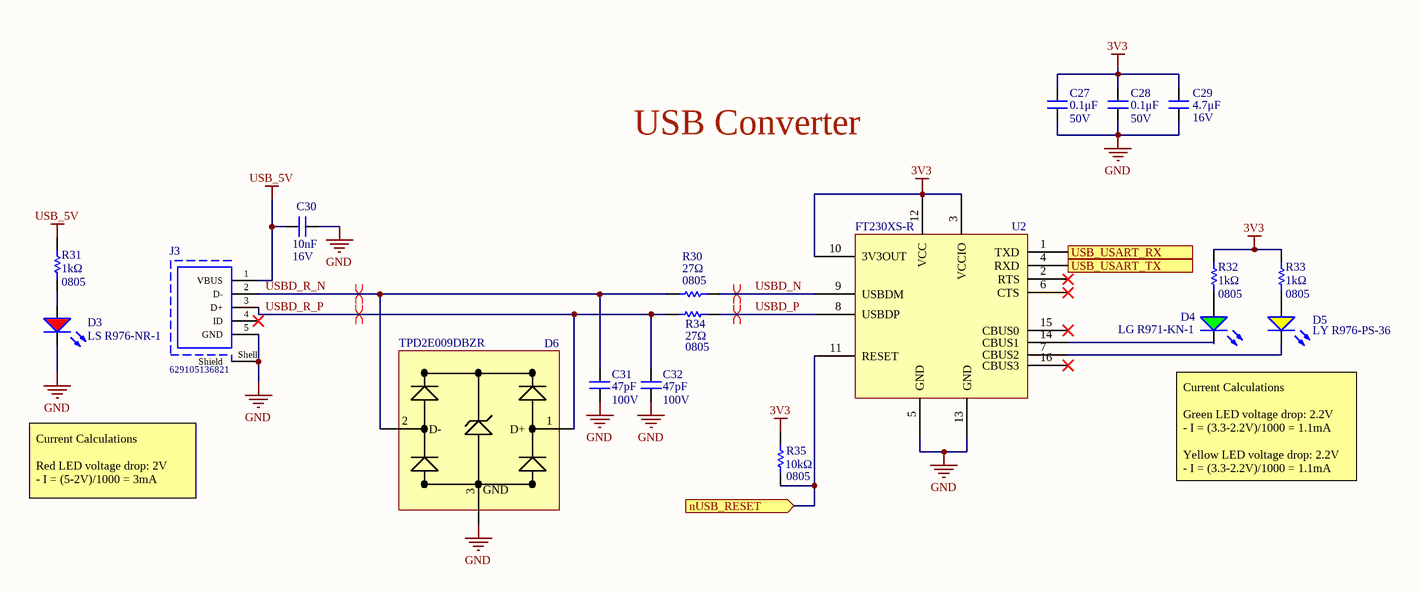
[diagram p2: SH3-FTDI.SchDoc]

### Parts
C27  0.1μF  Voltage Rating: 50V  [CAPC2012X140N]
C28  0.1μF  Voltage Rating: 50V  [CAPC2012X140N]
C29  value 4.7μF  Voltage Rating: 16V  [CAPC2012X140N]
C30  Capacitance: 10nF  Voltage Rating: 16V  [CAPC2012X140N]
C31  Capacitance: 47pF  Voltage Rating: 100V  [CAPC2012X140N]
C32  Capacitance: 47pF  Voltage Rating: 100V  [CAPC2012X140N]
D3  LS R976-NR-1  [LED_0805_LINE]
D4  LG R971-KN-1  [LED_0805_LINE]
D5  LY R976-PS-36  [LED_0805_LINE]
D6  Manufacturer Part Number: TPD2E009DBZR  [SOT23-3]  (hidden comment: TVS_DIODE_USB_5.5V)
J3  629105136821  [629105136821]
R30  Case/Package: 0805  Resistance: 27Ω  [RESC2012X60N]  (hidden comment: RES_27Ω_0805)
R31  1kΩ  Case Code (Imperial): 0805  [RESC2012X60N]
R32  1kΩ  Case Code (Imperial): 0805  [RESC2012X60N]
R33  1kΩ  Case Code (Imperial): 0805  [RESC2012X60N]
R34  Case/Package: 0805  Resistance: 27Ω  [RESC2012X60N]  (hidden comment: RES_27Ω_0805)
R35  value 10kΩ  Case Code (Imperial): 0805  [RESC2012X60N]  (hidden comment: RES_10kΩ_0805)
U2  Manufacturer Part Number 1: FT230XS-R  [SSOP16-0.635-5X4MM]  (hidden comment: IC_USB_TRANSCEIVER)

### Ports
nUSB_RESET (in), USB_USART_RX (out), USB_USART_TX (in)

### Nets
3V3: C27.2 C28.2 C29.2 R32.2 R33.2 R35.2 U2.3(VCCIO) U2.10(3V3OUT) U2.12(VCC)
GND: C27.1 C28.1 C29.1 C30.2 C31.2 C32.2 D3.2(K) D6.3(GND) J3.5(GND) J3.Shell(Shield) U2.5(GND) U2.13(GND)
USB_5V: C30.1 J3.1(VBUS) R31.2
USBD_N: R30.2 U2.9(USBDM)
USBD_P: R34.2 U2.8(USBDP)
USBD_R_N: C31.1 D6.2(D-) J3.2(D-) R30.1
USBD_R_P: C32.1 D6.1(D+) J3.3(D+) R34.1
NetD3_1: D3.1(A) R31.1
NetD4_1: D4.1(A) R32.1
NetD4_2: D4.2(K) U2.14(CBUS1)
NetD5_1: D5.1(A) R33.1
NetD5_2: D5.2(K) U2.7(CBUS2)
NetR35_1: R35.1 U2.11(RESET) ; port nUSB_RESET
NetTP6_1: U2.4(RXD) ; port USB_USART_TX
NetTP7_1: U2.1(TXD) ; port USB_USART_RX

Not connected (* = marked no-connect by the designer): J3 4(ID)*; U2 2(RTS)* 6(CTS)* 15(CBUS0)* 16(CBUS3)*

### Layout directives
differential pair: USBD_N, USBD_P, USBD_R_N, USBD_R_P

### Notes on the sheet
- USB Converter
- Current Calculations
  Red LED voltage drop: 2V
  - I = (5-2V)/1000 = 3mA
- Current Calculations
  Green LED voltage drop: 2.2V
  - I = (3.3-2.2V)/1000 = 1.1mA
  Yellow LED voltage drop: 2.2V
  - I = (3.3-2.2V)/1000 = 1.1mA
- Title
- Size:
- Date:
- Letter
- Drawn By:
- Sheet
- of
- File:

### Library data of the parts
C27 C28 = CAP_0.1uF_50V_0805: as C1 on sheet SH1-MCU; Mount: Surface Mount; Case Code (Metric): 2012; Case Code (Imperial): 0805; Min Operating Temperature: -55°C; Max Operating Temperature: 125°C; Dielectric: X7R; Termination: SMD/SMT; Length: 2mm; Height: 1.25mm; Width: 0.049inch; Thickness: 0.049inch; Depth: 1.25mm; Ratings: AEC-Q200; Supplier 1: Digi-Key; Supplier Part Number 1: 490-11955-1-ND; Package: 0805 (2012 Metric); Value: 0.1μF
C29 = CAP_4.7uF_16V_0805: as C5 on sheet SH1-MCU; Mount: Surface Mount; Case Code (Metric): 2012; Case Code (Imperial): 0805; Min Operating Temperature: -55°C; Max Operating Temperature: 85°C; Dielectric: X5R; Termination: SMD/SMT; Supplier 1: Digi-Key; Supplier Part Number 1: 1276-1065-1-ND; Package: 0805 (2012 Metric)
C30 = CAP_10nF_16V_0805: CAP CER 10000PF 16V X7R 0805; Manufacturer 1: Yageo; Manufacturer Part Number 1: AC0805KRX7R7BB103; Tolerance: 10%; Supplier 1: Digi-Key; Stock 1: 14344; Pricing 1: 1=0.20000, 10=0.13900, 100=0.07060, 500=0.04832, 1000=0.04275 (USD); RoHS: No; Mount: Surface Mount; Case/Package: 0805; Case Code (Imperial): 0805; Case Code (Metric): 2012; Min Operating Temperature: -55°C; Max Operating Temperature: 125°C; Packaging: Cut Tape; Ratings: AEC-Q200; ComponentLink1URL: http://www.yageo.com/NewPortal/_en/search/productDocs.jsp?YageoPartNumber=AC0805KRX7R7BB103&src-supplier=Digi-Key; ComponentLink1Description: http://www.yageo.com/NewPortal/_en/search/productDocs.jsp?YageoPartNumber=AC0805KRX7R7BB103&src-supplier=Digi-Key; Supplier Part Number 1: 311-3161-1-ND
C31 C32 = CAP_47pF_100V_0805: CAP CER 47PF 100V NPO 0805; Manufacturer 1: Yageo; Manufacturer Part Number 1: AC0805JRNPO0BN470; Tolerance: 5%; Supplier 1: Digi-Key; Stock 1: 2091; Pricing 1: 1=0.19000, 10=0.12600, 100=0.06400, 500=0.04376, 1000=0.03871 (USD); RoHS: No; Mount: Surface Mount; Case/Package: 0805; Case Code (Imperial): 0805; Case Code (Metric): 2012; Min Operating Temperature: -55°C; Max Operating Temperature: 125°C; Packaging: Tape and Reel; Ratings: AEC-Q200; ComponentLink1URL: http://www.yageo.com/NewPortal/_en/search/productDocs.jsp?YageoPartNumber=AC0805JRNPO0BN470&src-supplier=Digi-Key; ComponentLink1Description: http://www.yageo.com/NewPortal/_en/search/productDocs.jsp?YageoPartNumber=AC0805JRNPO0BN470&src-supplier=Digi-Key; Supplier Part Number 1: 311-3131-1-ND
D3 = DIO_LED_R: LED RED DIFFUSED 0805 SMD; Manufacturer 1: OSRAM; Forward Voltage Drop: 2V; Package: 0805 (2012 Metric); Manufacturer Part Number 1: LS R976-NR-1; Supplier Part Number 1: 475-1278-1-ND; Supplier 1: Digi-Key; Mount: Surface Mount
D4 = DIO_LED_G: as D2 on sheet SH1-MCU; Package: 0805 (2012 Metric); Manufacturer Part Number 1: LG R971-KN-1; Supplier Part Number 1: 475-1410-1-ND; Supplier 1: Digi-Key; Mount: Surface Mount
D5 = DIO_LED_Y: LED YELLOW DIFFUSED 0805 SMD; Manufacturer 1: OSRAM; Forward Voltage Drop: 2.2V; Package: 0805 (2012 Metric); Manufacturer Part Number 1: LY R976-PS-36; Supplier Part Number 1: 475-2560-1-ND; Supplier 1: Digi-Key; Mount: Surface Mount
D6 = TVS_DIODE_USB_5.5V: ESD Suppressor Diode Arrays 8KV 3-Pin SOT-23 T/R; Manufacturer: Texas Instruments; Direction: Unidirectional; Operating Supply Voltage: 6V; Capacitance: 0.9pF; Number of Channels: 2; Current Rating: 100nA; Peak Pulse Current: 1A; Element Configuration: Dual; Reverse Standoff Voltage: 5.5V; Min Breakdown Voltage: 9V; Clamping Voltage: 8V; Peak Pulse Power: 45W; Power Line Protection: Yes; Breakdown Voltage: 7V; Interface: LVDS,PCIe,SATA; Supplier 1: Digi-Key; RoHS: Yes; Category: Interface ICs; Stock 1: 98615; Pricing 1: 1=0.56000, 10=0.48000, 25=0.44800, 100=0.33280, 250=0.31616, 500=0.25984, 1000=0.21120 (USD); Case/Package: SOT-23; Number of Pins: 3; Min Operating Temperature: -40°C; Max Operating Temperature: 85°C; Packaging: Tape and Reel; Package Quantity: 1; Number of Bidirectional Channels: 2; Termination: SMD/SMT; Max Power Dissipation: 45W; Working Voltage: 5.5V; Length: 2.92mm; Height: 1mm; Width: 1.3mm; Depth: 1.3mm; Radiation Hardening: No; REACH SVHC: No SVHC; Lead Free: Lead Free; ComponentLink1URL: https://datasheet.ciiva.com/353/tpd2e009-353266.pdf?src-supplier=Digi-Key; ComponentLink1Description: https://datasheet.ciiva.com/353/tpd2e009-353266.pdf?src-supplier=Digi-Key; ComponentLink2URL: https://datasheet.ciiva.com/15134/getdatasheetpartid-243395-15134537.pdf?src-supplier=Verical; ComponentLink2Description: https://datasheet.ciiva.com/15134/getdatasheetpartid-243395-15134537.pdf?src-supplier=Verical; ComponentLink3URL: https://datasheet.ciiva.com/4479/slvs953a-121037-4479453.pdf?src-supplier=Mouser; ComponentLink3Description: https://datasheet.ciiva.com/4479/slvs953a-121037-4479453.pdf?src-supplier=Mouser; ComponentLink4URL: https://datasheet.ciiva.com/353/tpd2e009-353268.pdf?src-supplier=Digi-Key; ComponentLink4Description: https://datasheet.ciiva.com/353/tpd2e009-353268.pdf?src-supplier=Digi-Key; ComponentLink5URL: https://datasheet.ciiva.com/353/tpd2e009-353267.pdf?src-supplier=Digi-Key; ComponentLink5Description: https://datasheet.ciiva.com/353/tpd2e009-353267.pdf?src-supplier=Digi-Key; ComponentLink6URL: https://datasheet.ciiva.com/46384/1707898-46384524.pdf?src-supplier=Element14; ComponentLink6Description: https://datasheet.ciiva.com/46384/1707898-46384524.pdf?src-supplier=Element14; Supplier Part Number 1: 296-24657-1-ND
J3 = CMP-1502-03253-1: Micro USB 2.0 Type B Receptacle WR-COM, Horizontal, SMT, with Pads and Pegs; Manufacturer: Wurth Elektronik; Contact Resistance: 30mOhm; Rated Current: 1A; Working Voltage: 30VAC; Datasheet URL: https://katalog.we-online.de/em/datasheet/629105136821.pdf; Mounting Technology: SMT; Publisher: WurthElektronik; Package Reference: 629105136821; Orientation: Horizontal; Packaging: TapeandReel; Part Number: 629105136821; Manufacturer URL: http://www.we-online.de; Connector Type: MicroUSB2.0TypeB; Gender: Receptacle; Operating Temperature: -40to105degC
R30 R34 = RES_27Ω_0805: RES SMD 27 OHM 1% 1/8W 0805; Manufacturer 1: Yageo; Manufacturer Part Number 1: RC0805FR-0727RL; Temperature Coefficient: 100ppm/°C; Working Voltage: 150V; Power Rating: 125mW; Supplier 1: Digi-Key; Stock 1: 345388; Pricing 1: 1=0.10000, 10=0.04000, 100=0.01630, 1000=0.00731, 2500=0.00635 (USD); RoHS: Yes; Case Code (Imperial): 0805; Case Code (Metric): 2012; Min Operating Temperature: -55°C; Max Operating Temperature: 155°C; Tolerance: 1%; Composition: Thick Film; Packaging: Tape and Reel; Number of Terminations: 2; Termination: SMD/SMT; Voltage Rating: 150V; Military Standard: Not; Length: 2mm; Height: 0.5mm; Width: 1.25mm; Depth: 1.25mm; REACH SVHC: Unknown; Lead Free: Lead Free; ComponentLink1URL: https://datasheet.ciiva.com/12561/rc0805-257173-12561222.pdf?src-supplier=Mouser; ComponentLink1Description: https://datasheet.ciiva.com/12561/rc0805-257173-12561222.pdf?src-supplier=Mouser; ComponentLink2URL: https://datasheet.ciiva.com/7941/444164-7941752.pdf?src-supplier=Element14; ComponentLink2Description: https://datasheet.ciiva.com/7941/444164-7941752.pdf?src-supplier=Element14; ComponentLink3URL: https://datasheet.ciiva.com/7941/444164-7941753.pdf?src-supplier=Element14; ComponentLink3Description: https://datasheet.ciiva.com/7941/444164-7941753.pdf?src-supplier=Element14; Supplier Part Number 1: 311-27.0CRCT-ND
R31-R33 = RES_1kΩ_0805: RES SMD 1K OHM 1% 1/8W 0805; Manufacturer 1: Yageo; Manufacturer Part Number 1: RC0805FR-071KL; Power Rating: 125mW; Temperature Coefficient: 25ppm/°C; Voltage Rating: 150V; Supplier 1: Digi-Key; Case Code (Metric): 2012; Min Operating Temperature: -55°C; Max Operating Temperature: 155°C; Resistance: 1K; Tolerance: 1%; Termination: SMD/SMT; Supplier Part Number 1: 311-1.00KCRCT-ND; Package: 0805 (2012 Metric); Value: 1kΩ; RoHS: Yes; Mount: Surface Mount; Case/Package: 0805; Number of Pins: 2; Weight: 0.000194oz; Contact Plating: Tin; Packaging: Tape and Reel; Composition: Thin Film; Number of Terminations: 2; Voltage Rating (DC): 150V; Max Power Dissipation: 125mW; Package Quantity: 1000; Features: Moisture Resistant,Automotive AEC-Q200,Anti-Sulfur; Military Standard: Not; Length: 2mm; Height: 0.022inch; Width: 0.049inch; Depth: 1.25mm; Radiation Hardening: No; Lead Free: Lead Free; REACH SVHC: Unknown; ComponentLink1URL: https://datasheet.ciiva.com/9003/tnpw-e3-9003481.pdf?src-supplier=Avnet; ComponentLink1Description: https://datasheet.ciiva.com/9003/tnpw-e3-9003481.pdf?src-supplier=Avnet; ComponentLink2URL: https://datasheet.ciiva.com/9003/tnpw-e3-9003543.pdf?src-supplier=Avnet; ComponentLink2Description: https://datasheet.ciiva.com/9003/tnpw-e3-9003543.pdf?src-supplier=Avnet
R35 = RES_10kΩ_0805: as R5 on sheet SH1-MCU; Supplier 1: Digi-Key; Case Code (Metric): 2012; Min Operating Temperature: -55°C; Max Operating Temperature: 155°C; Resistance: 10K; Tolerance: 1%; Termination: SMD/SMT; Supplier Part Number 1: 311-10.0KCRCT-ND; Package: 0805 (2012 Metric)
U2 = IC_USB_TRANSCEIVER: Manufacturer 1: FTDI, Future Technology Devices International Ltd; Supplier 1: Digi-Key; Supplier Part Number 1: 768-1135-1-ND